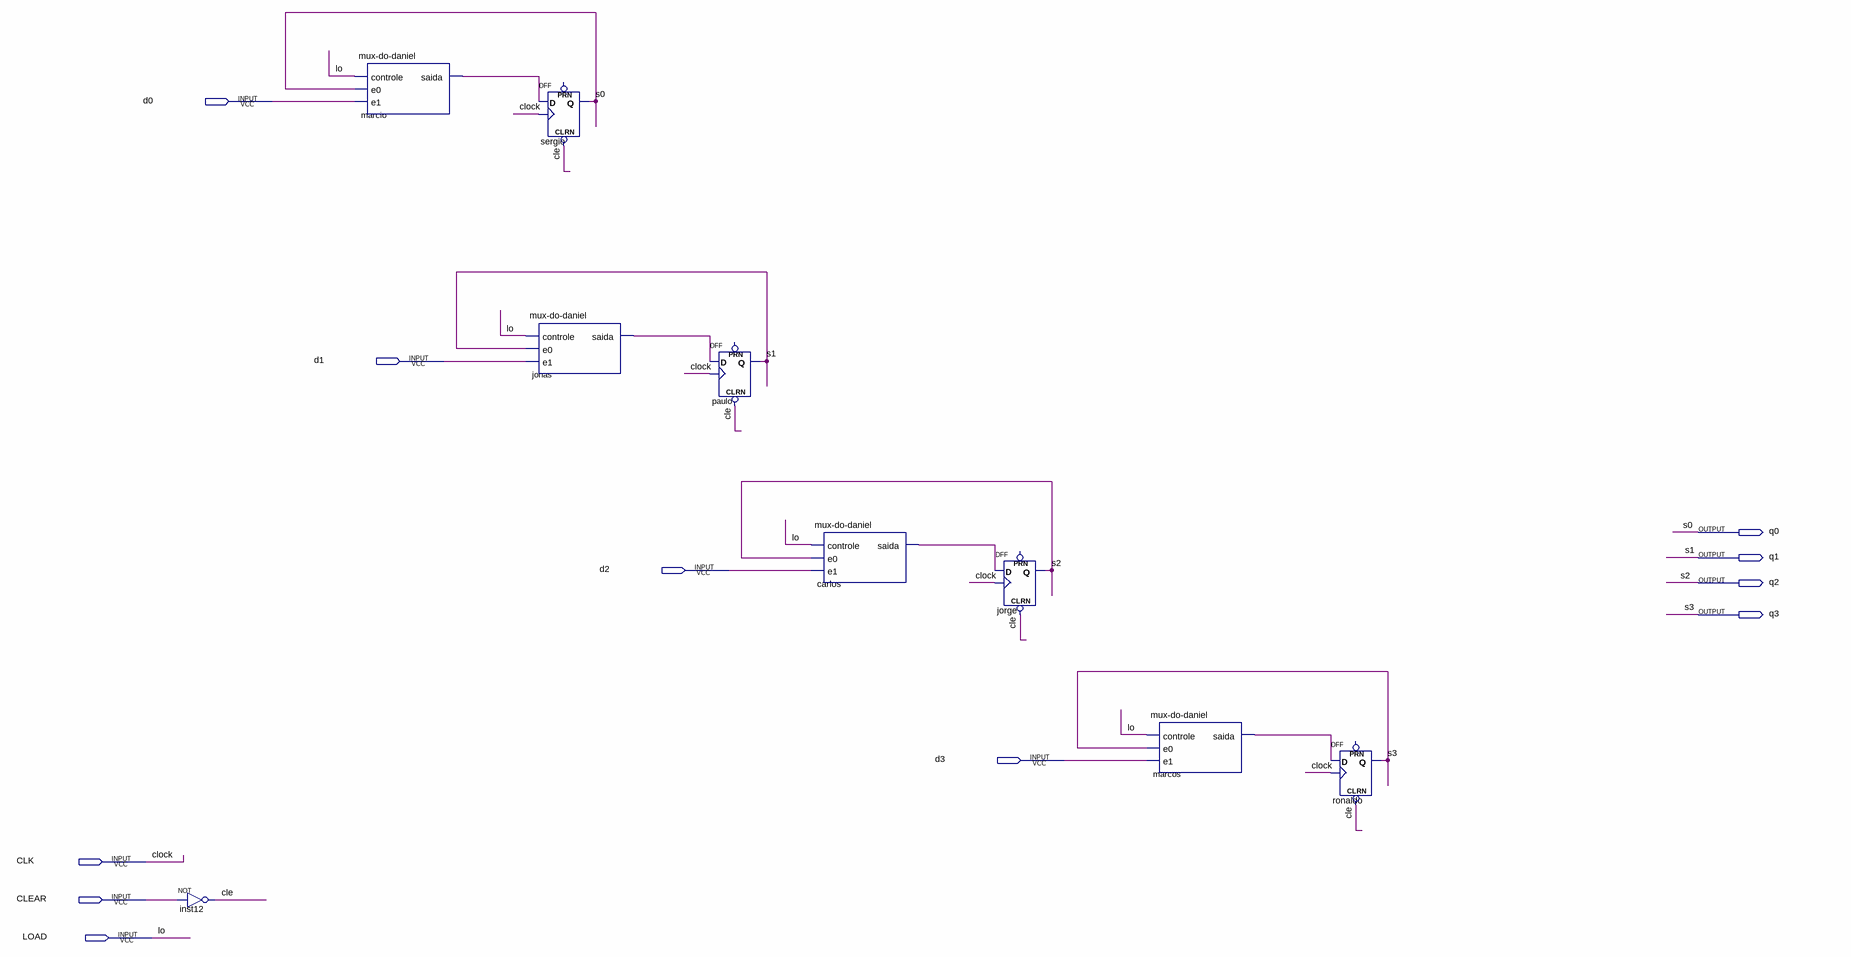
[diagram p0: schematic sheet]
// Quartus schematic registrador.bdf as structural Verilog: 9 symbols, 11 pins
module registrador (
  input  d0,
  input  d1,
  input  d2,
  input  d3,
  input  CLK,
  input  CLEAR,
  input  LOAD,
  output q0,
  output q1,
  output q2,
  output q3
);

  wire carlos_saida, cle, jonas_saida, marcio_saida, marcos_saida;

  not inst12 (cle, CLEAR);
  \mux-do-daniel  marcio (.controle(LOAD), .e0(q0), .e1(d0), .saida(marcio_saida));
  DFF sergio (.CLRN(cle), .CLK(CLK), .D(marcio_saida), .Q(q0));  // open: PRN
  \mux-do-daniel  jonas (.controle(LOAD), .e0(q1), .e1(d1), .saida(jonas_saida));
  DFF paulo (.CLRN(cle), .CLK(CLK), .D(jonas_saida), .Q(q1));  // open: PRN
  \mux-do-daniel  carlos (.controle(LOAD), .e0(q2), .e1(d2), .saida(carlos_saida));
  DFF jorge (.CLRN(cle), .CLK(CLK), .D(carlos_saida), .Q(q2));  // open: PRN
  \mux-do-daniel  marcos (.controle(LOAD), .e0(q3), .e1(d3), .saida(marcos_saida));
  DFF ronaldo (.CLRN(cle), .CLK(CLK), .D(marcos_saida), .Q(q3));  // open: PRN

  // Other names for the same wires on the sheet: clock = CLK; lo = LOAD; s0 = q0; s1 = q1; s2 = q2; s3 = q3
endmodule
